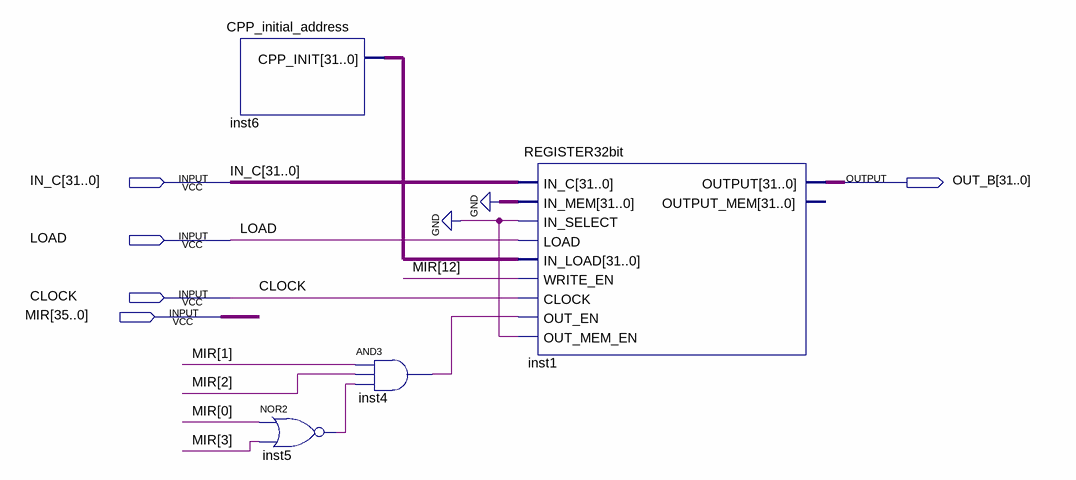
[diagram p0: schematic sheet]
// Quartus schematic CPP.bdf as structural Verilog: 4 symbols, 5 pins
module CPP (
  input  [31:0] IN_C,
  input  LOAD,
  input  CLOCK,
  input  [35:0] MIR,
  output [31:0] OUT_B
);

  wire inst4_out, inst5_out;
  wire [31:0] inst6_cpp_init;

  CPP_initial_address inst6 (.CPP_INIT(inst6_cpp_init));
  nor inst5 (inst5_out, MIR[0], MIR[3]);
  and inst4 (inst4_out, MIR[1], MIR[2], inst5_out);
  REGISTER32bit inst1 (
    .IN_C(IN_C), .IN_MEM({32{1'b0}}), .IN_SELECT(1'b0), .LOAD(LOAD), .IN_LOAD(inst6_cpp_init),
    .WRITE_EN(MIR[12]), .CLOCK(CLOCK), .OUT_EN(inst4_out), .OUT_MEM_EN(1'b0), .OUTPUT(OUT_B));  // open: OUTPUT_MEM
endmodule
